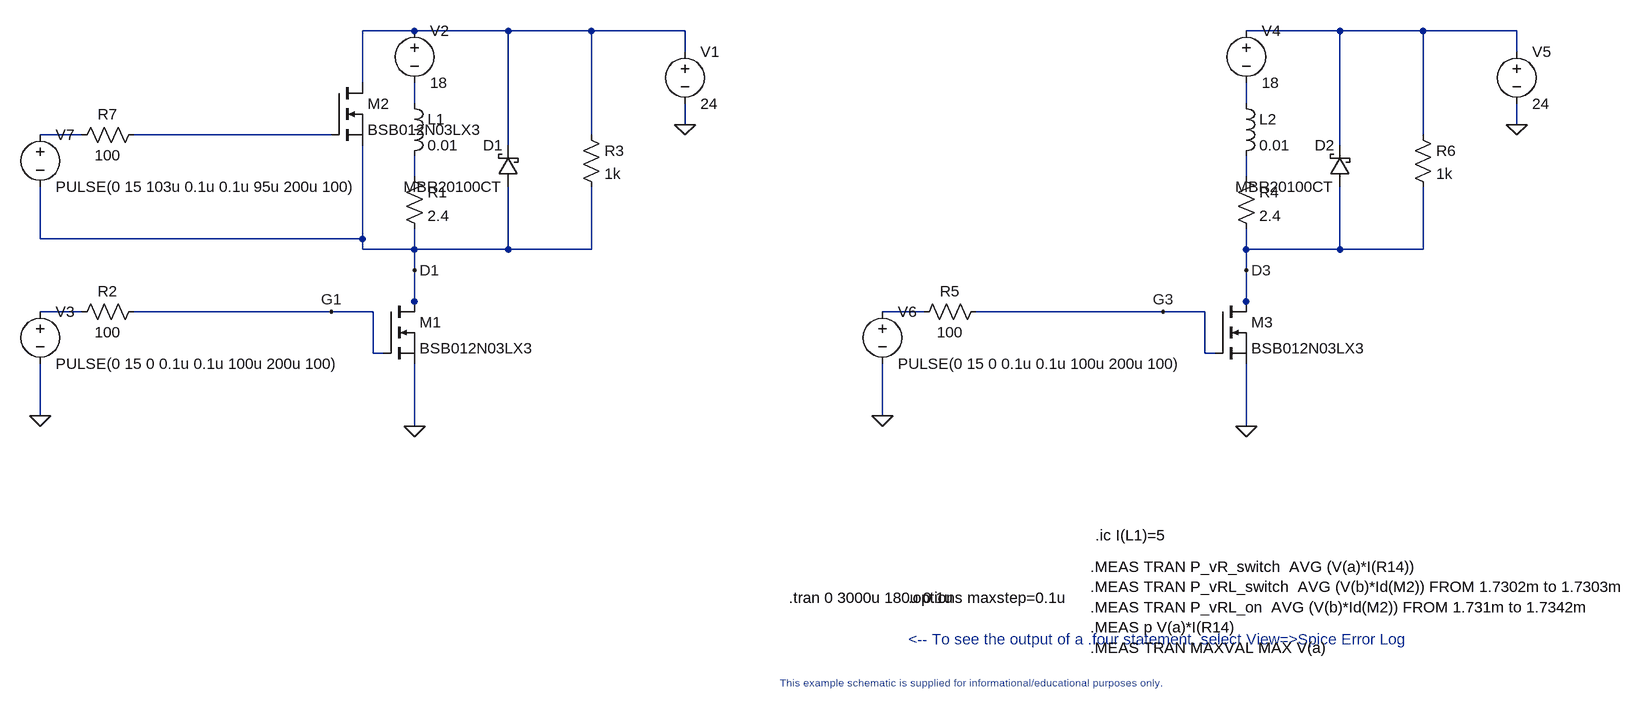
[diagram p0: schematic FetSwitchHalbBrueInversBFH1.asc]
FetSwitchHalbBrueInversBFH1.asc, the LTspice schematic file:
Version 4
SHEET 1 2516 2032
WIRE -1312 128 -1392 128
WIRE -1168 128 -1312 128
WIRE -1040 128 -1168 128
WIRE -896 128 -1040 128
WIRE 112 128 -32 128
WIRE 240 128 112 128
WIRE 384 128 240 128
WIRE -896 160 -896 128
WIRE 384 160 384 128
WIRE -1392 208 -1392 128
WIRE -1312 240 -1312 208
WIRE -32 240 -32 208
WIRE -896 272 -896 240
WIRE 384 272 384 240
WIRE -1824 288 -1888 288
WIRE -1440 288 -1744 288
WIRE -1040 288 -1040 128
WIRE 240 288 240 128
WIRE -1168 304 -1168 128
WIRE 112 304 112 128
WIRE -1312 352 -1312 320
WIRE -32 352 -32 320
WIRE -1888 448 -1888 368
WIRE -1392 448 -1392 304
WIRE -1392 448 -1888 448
WIRE -1392 464 -1392 448
WIRE -1312 464 -1312 432
WIRE -1312 464 -1392 464
WIRE -1168 464 -1168 368
WIRE -1168 464 -1312 464
WIRE -1040 464 -1040 368
WIRE -1040 464 -1168 464
WIRE -32 464 -32 432
WIRE 112 464 112 368
WIRE 112 464 -32 464
WIRE 240 464 240 368
WIRE 240 464 112 464
WIRE -1312 496 -1312 464
WIRE -32 496 -32 464
WIRE -1312 544 -1312 496
WIRE -32 544 -32 496
WIRE -1824 560 -1888 560
WIRE -1440 560 -1744 560
WIRE -1376 560 -1440 560
WIRE -1312 560 -1312 544
WIRE -528 560 -592 560
WIRE -160 560 -448 560
WIRE -96 560 -160 560
WIRE -32 560 -32 544
WIRE -1376 624 -1376 560
WIRE -1360 624 -1376 624
WIRE -96 624 -96 560
WIRE -80 624 -96 624
WIRE -1888 720 -1888 640
WIRE -592 720 -592 640
WIRE -1312 736 -1312 640
WIRE -32 736 -32 640
FLAG 384 272 0
FLAG -32 736 0
FLAG -32 496 D3
FLAG -160 560 G3
FLAG -592 720 0
FLAG -896 272 0
FLAG -1312 736 0
FLAG -1312 496 D1
FLAG -1440 560 G1
FLAG -1888 720 0
SYMBOL VOLTAGE 384 144 R0
WINDOW 123 0 0 Left 2
WINDOW 39 0 0 Left 2
SYMATTR InstName V5
SYMATTR Value 24
SYMBOL res -48 336 R0
SYMATTR InstName R4
SYMATTR Value 2.4
SYMBOL res -432 544 R90
WINDOW 0 0 56 VBottom 2
WINDOW 3 32 56 VTop 2
SYMATTR InstName R5
SYMATTR Value 100
SYMBOL nmos -80 544 R0
SYMATTR InstName M3
SYMATTR Value BSB012N03LX3
SYMBOL ind -48 224 R0
SYMATTR InstName L2
SYMATTR Value 0.01
SYMATTR SpiceLine Ipk=9
SYMBOL schottky 128 368 R180
WINDOW 0 24 64 Left 2
WINDOW 3 24 0 Left 2
SYMATTR InstName D2
SYMATTR Value MBR20100CT
SYMATTR Description Diode
SYMATTR Type diode
SYMBOL VOLTAGE -32 112 R0
WINDOW 123 0 0 Left 2
WINDOW 39 0 0 Left 2
SYMATTR InstName V4
SYMATTR Value 18
SYMBOL voltage -592 544 R0
WINDOW 123 0 0 Left 2
WINDOW 39 0 0 Left 2
SYMATTR InstName V6
SYMATTR Value PULSE(0 15 0 0.1u 0.1u 100u 200u 100)
SYMBOL res 224 272 R0
SYMATTR InstName R6
SYMATTR Value 1k
SYMBOL VOLTAGE -896 144 R0
WINDOW 123 0 0 Left 2
WINDOW 39 0 0 Left 2
SYMATTR InstName V1
SYMATTR Value 24
SYMBOL res -1328 336 R0
SYMATTR InstName R1
SYMATTR Value 2.4
SYMBOL res -1728 544 R90
WINDOW 0 0 56 VBottom 2
WINDOW 3 32 56 VTop 2
SYMATTR InstName R2
SYMATTR Value 100
SYMBOL nmos -1360 544 R0
SYMATTR InstName M1
SYMATTR Value BSB012N03LX3
SYMBOL ind -1328 224 R0
SYMATTR InstName L1
SYMATTR Value 0.01
SYMATTR SpiceLine Ipk=9
SYMBOL schottky -1152 368 R180
WINDOW 0 24 64 Left 2
WINDOW 3 24 0 Left 2
SYMATTR InstName D1
SYMATTR Value MBR20100CT
SYMATTR Description Diode
SYMATTR Type diode
SYMBOL VOLTAGE -1312 112 R0
WINDOW 123 0 0 Left 2
WINDOW 39 0 0 Left 2
SYMATTR InstName V2
SYMATTR Value 18
SYMBOL voltage -1888 544 R0
WINDOW 123 0 0 Left 2
WINDOW 39 0 0 Left 2
SYMATTR InstName V3
SYMATTR Value PULSE(0 15 0 0.1u 0.1u 100u 200u 100)
SYMBOL res -1056 272 R0
SYMATTR InstName R3
SYMATTR Value 1k
SYMBOL res -1728 272 R90
WINDOW 0 0 56 VBottom 2
WINDOW 3 32 56 VTop 2
SYMATTR InstName R7
SYMATTR Value 100
SYMBOL voltage -1888 272 R0
WINDOW 123 0 0 Left 2
WINDOW 39 0 0 Left 2
SYMATTR InstName V7
SYMATTR Value PULSE(0 15 103u 0.1u 0.1u 95u 200u 100)
SYMBOL nmos -1440 208 R0
SYMATTR InstName M2
SYMATTR Value BSB012N03LX3
TEXT -736 1000 Left 2 !.tran 0 3000u 180u 0.1u
TEXT -552 1000 Left 2 !.options maxstep=0.1u
TEXT -464 1120 Top 1 ;This example schematic is supplied for informational/educational purposes only.
TEXT -552 1064 Left 2 ;<-- To see the output of a .four statement, select View=>Spice Error Log
TEXT -272 952 Left 2 !.MEAS TRAN P_vR_switch  AVG (V(a)*I(R14)) \n.MEAS TRAN P_vRL_switch  AVG (V(b)*Id(M2)) FROM 1.7302m to 1.7303m\n.MEAS TRAN P_vRL_on  AVG (V(b)*Id(M2)) FROM 1.731m to 1.7342m\n.MEAS p V(a)*I(R14)\n.MEAS TRAN MAXVAL MAX V(a)
TEXT -264 904 Left 2 !.ic I(L1)=5

The netlist it stands for:
* FetSwitchHalbBrueInversBFH1.asc
V5 N002 0 24
R4 N008 D3 2.4
R5 G3 N010 100
M3 D3 G3 0 0 BSB012N03LX3
L2 N004 N008 0.01 Ipk=9
D2 D3 N002 MBR20100CT
V4 N002 N004 18
V6 N010 0 PULSE(0 15 0 0.1u 0.1u 100u 200u 100)
R6 N002 D3 1k
V1 N001 0 24
R1 N007 D1 2.4
R2 G1 N009 100
M1 D1 G1 0 0 BSB012N03LX3
L1 N003 N007 0.01 Ipk=9
D1 D1 N001 MBR20100CT
V2 N001 N003 18
V3 N009 0 PULSE(0 15 0 0.1u 0.1u 100u 200u 100)
R3 N001 D1 1k
R7 N006 N005 100
V7 N005 D1 PULSE(0 15 103u 0.1u 0.1u 95u 200u 100)
M2 N001 N006 D1 D1 BSB012N03LX3
.model D D
.lib standard.dio
.model NMOS NMOS
.model PMOS PMOS
.lib standard.mos
.tran 0 3000u 180u 0.1u
.options maxstep=0.1u
* This example schematic is supplied for informational/educational purposes only.
* <-- To see the output of a .four statement, select View=>Spice Error Log
.MEAS TRAN P_vR_switch  AVG (V(a)*I(R14))
.MEAS TRAN P_vRL_switch  AVG (V(b)*Id(M2)) FROM 1.7302m to 1.7303m
.MEAS TRAN P_vRL_on  AVG (V(b)*Id(M2)) FROM 1.731m to 1.7342m
.MEAS p V(a)*I(R14)
.MEAS TRAN MAXVAL MAX V(a)
.ic I(L1)=5
.backanno
.end